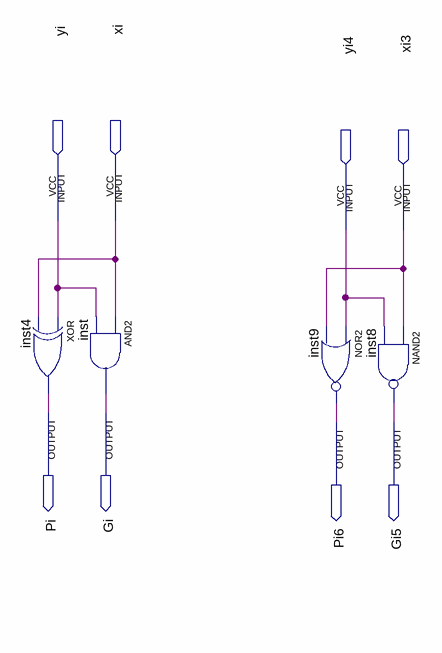
[diagram p0: schematic sheet]
// Quartus schematic P_G_block.bdf as structural Verilog: 4 symbols, 8 pins
module P_G_block (
  input  yi,
  input  xi,
  input  yi4,
  input  xi3,
  output Pi,
  output Gi,
  output Pi6,
  output Gi5
);

  xor inst4 (Pi, yi, xi);
  and inst (Gi, xi, yi);
  nor inst9 (Pi6, yi4, xi3);
  nand inst8 (Gi5, xi3, yi4);
endmodule
